# Altium schematic sheet STIM300IMU.SchDoc
size A4
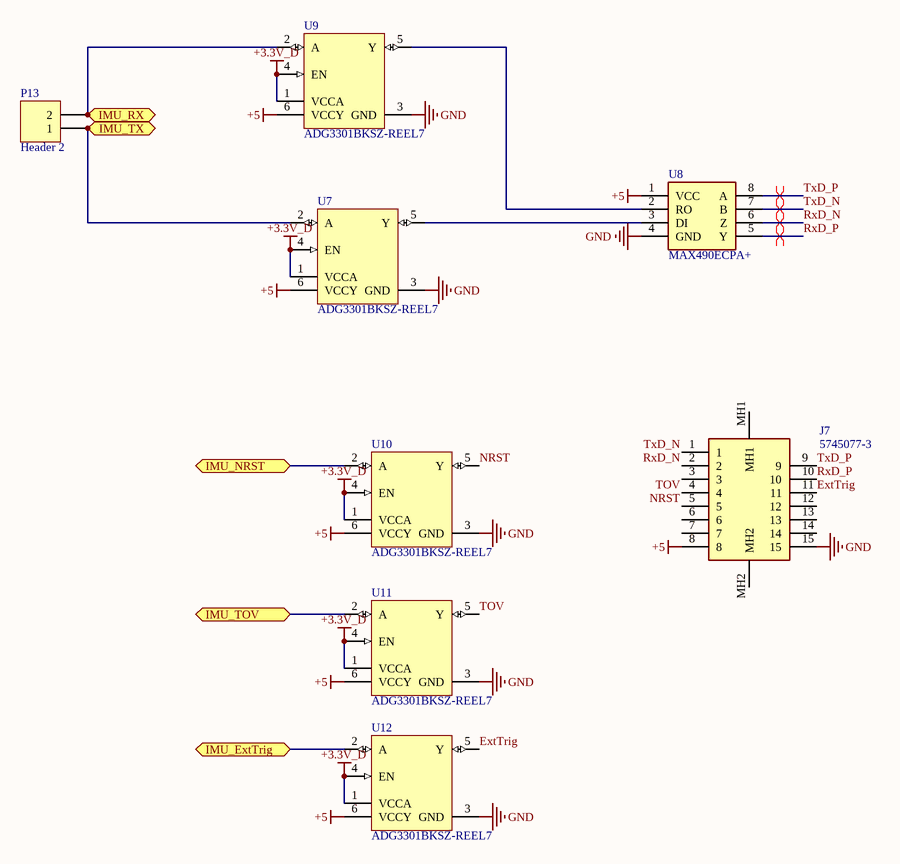
[diagram p0: STIM300IMU.SchDoc]

## Parts
J7  5745077-3  [2301840-1]
P13  Header 2  [HDR1X2]
U7  ADG3301BKSZ-REEL7  [ADI-KS-6_N]
U8  MAX490ECPA+  [DIP762W56P254L938H457Q8N]
U9  ADG3301BKSZ-REEL7  [ADI-KS-6_N]
U10  ADG3301BKSZ-REEL7  [ADI-KS-6_N]
U11  ADG3301BKSZ-REEL7  [ADI-KS-6_N]
U12  ADG3301BKSZ-REEL7  [ADI-KS-6_N]

## Ports
IMU_ExtTrig (bidir), IMU_NRST (bidir), IMU_RX (bidir), IMU_TOV (bidir), IMU_TX (bidir)

## Nets
+3.3V_D: U7.1(VCCA) U7.4(EN) U9.1(VCCA) U9.4(EN) U10.1(VCCA) U10.4(EN) U11.1(VCCA) U11.4(EN) U12.1(VCCA) U12.4(EN)
+5: J7.8 U7.6(VCCY) U8.1(VCC) U9.6(VCCY) U10.6(VCCY) U11.6(VCCY) U12.6(VCCY)
GND: J7.15 U7.3(GND) U8.4(GND) U9.3(GND) U10.3(GND) U11.3(GND) U12.3(GND)
ExtTrig: J7.11 U12.5(Y)
IMU_ExtTrig: U12.2(A) ; port IMU_ExtTrig
IMU_NRST: U10.2(A) ; port IMU_NRST
IMU_RX: P13.2 U9.2(A) ; port IMU_RX
IMU_TOV: U11.2(A) ; port IMU_TOV
IMU_TX: P13.1 U7.2(A) ; port IMU_TX
NRST: J7.5 U10.5(Y)
RxD_N: J7.2 U8.6(Z)
RxD_P: J7.10 U8.5(Y)
TOV: J7.4 U11.5(Y)
TxD_N: J7.1 U8.7(B)
TxD_P: J7.9 U8.8(A)
NetU7_5: U7.5(Y) U8.3(DI)
NetU8_2: U8.2(RO) U9.5(Y)

Not connected (* = marked no-connect by the designer): J7 3 6 7 12 13 14 MH1 MH2

## Layout directives
differential pair: RxD_N, RxD_P, TxD_N, TxD_P

## Library data of the parts
J7 = 5745077-3: Connector; Manufacturer_Name: TE Connectivity; Datasheet Link: https://www.te.com/commerce/DocumentDelivery/DDEController?Action=srchrtrv&DocNm=5745077&DocType=Customer+Drawing&DocLang=English; Height: 12.55mm; Manufacturer_Part_Number: 5745077-3
P13 = Header 2: Header, 2-Pin; LatestRevisionDate: 17-Jul-2002; LatestRevisionNote: Re-released for DXP Platform.; Publisher: Altium Limited
U7 U9-U12 = CMP-0791-00015-1: Low Voltage 1.15 V to 5.5 V, Single-Channel Bidirectional Logic Level Translator, -40 to 85 degC, 6-pin SOT (KS-6), Reel; Manufacturer: Analog Devices; Bus Enable Time (typ): 1us; ComponentLink2URL: http://www.analog.com/static/imported-files/data_sheets/ADG3301.pdf; PackageDescription: 6-Pin Thin Shrink Small Outline Transistor Package, Body 2 x 1.25 mm, Pitch 0.65 mm; PackageReference: KS-6; ComponentLink1Description: Manufacturer URL; DatasheetVersion: Rev. 0; ComponentLink3Description: Package Specification; ComponentLink1URL: http://www.analog.com/en/index.html; ComponentLink3URL: http://www.analog.com/static/imported-files/packages/PKG_PDF/SC70(KS)/KS_6.pdf; Code_JEDEC: MO-203-AB; PartNumber: ADG3301BKSZ-REEL7; Mounting Technology: Surface Mount; ComponentLink2Description: Datasheet; PackageVersion: 072809-A, 07/2009
U8 = MAX490ECPA+: Integrated Circuit; Manufacturer_Name: Maxim Integrated; Datasheet Link: https://www.mouser.in/datasheet/2/256/MAX1487E-MAX491E-1291632.pdf; Height: 4.572mm; Manufacturer_Part_Number: MAX490ECPA+; Mouser Part Number: 700-MAX490ECPA; Mouser Price/Stock: https://www.mouser.co.uk/ProductDetail/Maxim-Integrated/MAX490ECPA%2b?qs=1THa7WoU59FmiTWtxqzJXQ%3D%3D